# Altium project ECG.PrjPcb
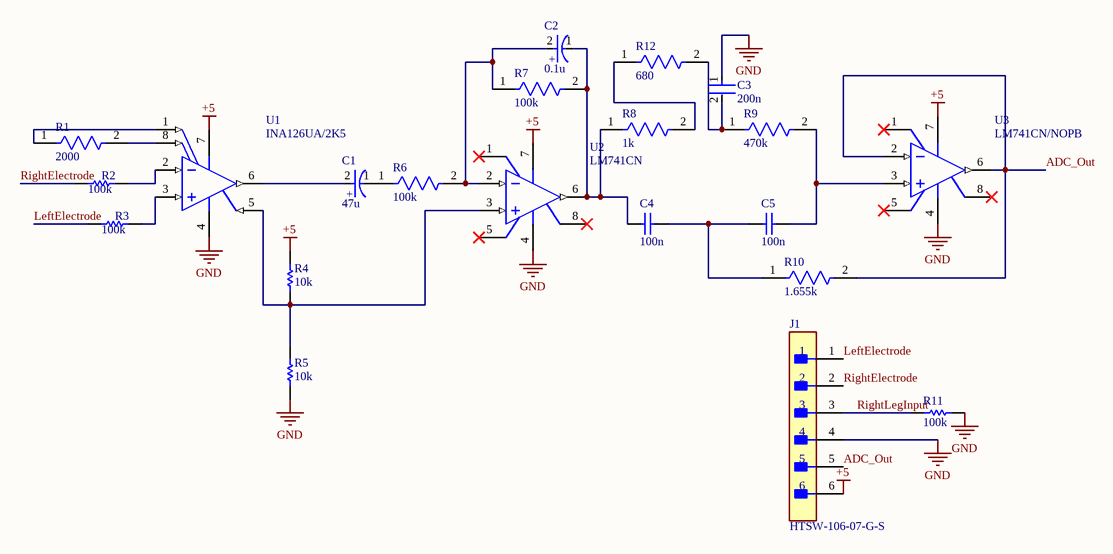
[diagram p0: ECG.SchDoc]
1 sheet, 21 parts. Net scope: global (net labels, ports and power ports of the same name join across sheets).
Board files: ECG_old.PcbDoc, ECG.PcbDoc

## Sheet ECG.SchDoc
size A; SheetNumber: 1; SheetTotal: 1

### Parts
C1  47u  [FP-RAD-TH-D_8_0_5-L_20_2-MFG]
C2  0.1u  [FP-RAD-TH-D_8_0_5-L_20_2-MFG]
C3  200n  [FP-R82DC4100DQ60J-MFG]
C4  100n  [CAPR51-254-508X318X736]
C5  100n  [CAPR51-254-508X318X736]
J1  HTSW-106-07-G-S  [FP-HTSW-106-07-G-S-MFG]
R1  2000  [FP-MRS25-MFG]
R2  value 100k  [6-0805_N]  (hidden comment: Res 0805)
R3  value 100k  [6-0805_N]  (hidden comment: Res 0805)
R4  value 10k  [6-0805_N]  (hidden comment: Res 0805)
R5  value 10k  [6-0805_N]  (hidden comment: Res 0805)
R6  100k  [FP-MRS25-MFG]
R7  100k  [FP-MRS25-MFG]
R8  1k  [FP-MRS25-MFG]
R9  470k  [FP-MRS25-MFG]
R10  1.655k  [FP-MRS25-MFG]
R11  value 100k  [6-0805_N]  (hidden comment: Res 0805)
R12  680  [FP-MRS25-MFG]
U1  INA126UA/2K5  [D0008A_N]
U2  LM741CN  [P0008A]
U3  LM741CN/NOPB  [P0008A]

### Nets
+5: J1.6 R4.2 U1.7(V+) U2.7(V+) U3.7(V+)
GND: C3.1 J1.4 R5.1 R11.2 U1.4(V-) U2.4(V-) U3.4(V-)
ADC_Out: J1.5 R10.2 U3.2(IN-) U3.6(OUT)
LeftElectrode: J1.1 R3.1
RightElectrode: J1.2 R2.1
RightLegInput: J1.3 R11.1
NetC1_1: C1.1(C) R6.1
NetC1_2: C1.2(A) U1.6(VO)
NetC2_1: C2.1(C) C4.1 R7.2 R8.1 U2.6(OUT)
NetC2_2: C2.2(A) R6.2 R7.1 U2.2(IN-)
NetC3_2: C3.2 R9.1 R12.2
NetC4_2: C4.2 C5.1 R10.1
NetC5_2: C5.2 R9.2 U3.3(IN+)
NetR1_1: R1.1 U1.1(RG)
NetR1_2: R1.2 U1.8(RG)
NetR2_2: R2.2 U1.2(VIN-)
NetR3_2: R3.2 U1.3(VIN+)
NetR4_1: R4.1 R5.2 U1.5(REF) U2.3(IN+)
NetR8_2: R8.2 R12.1

Not connected (* = marked no-connect by the designer): U2 1(OFS_NULL)* 5(OFS_NULL)* 8(NC)*; U3 1(OFS_NULL)* 5(OFS_NULL)* 8(NC)*

### Notes on the sheet
- (in symbol CMP-05427-001204-1) +

### Library data of the parts
C1 C2 = CMP-05427-001204-1: Aluminum Electrolytic Capacitors (Radial Lead Type) AEC-Q200 Qualified 270uF ±20% 35V
C3 = CMP-03022-000017-1: CAP FILM 1UF 5% 63VDC RADIAL; Voltage Rating (DC): 63V; Lead Diameter: 0.5mm; Insulation Resistance: 30R; Dielectric: PET; Voltage Rating (AC): 40V; Dissipation Factor: 80%; Life (Hours): 2000Hour; Type: General Purpose; Mount: Through Hole; Case/Package: Radial; Package Quantity: 1700; Construction: RADIAL; Capacitance: 1uF; Lead Pitch: 5mm; Depth: 5mm; Series: R82; Packaging: Tape and Reel; RoHS Compliant: Yes; Voltage Rating: 63V; Height - Seated (Max): 0.398inch; Voltage: 63V; Radiation Hardening: No; Width: 5mm; REACH SVHC: No SVHC; Min Operating Temperature: -55°C; Tolerance: 5%; Dielectric Material: PET; Contact Plating: Tin; Termination: Radial; Length: 7.2mm; Max Operating Temperature: 105°C
C4 C5 = CMP-1664-00004-1: Radial Leaded Multilayer Ceramic Capacitor, 0.1 uF, +/- 10%, 50 V, -55 to 125 degC, 2-Pin THD, RoHS, Tape and Reel; Case\Package: SOT-23-5; Max Power Dissipation: 250 mW; Output Current: 150 mA; Dropout Voltage: 260 mV; Outputs: 1; Output Voltage: 5 V; Max Input Voltage: 8 V; Min Operating Temperature: -40 degC; Packaging: Tape and Reel; Height: 1.3 mm; Radiation Hardening: No; Pins: 5; ComponentLink1Description: Manufacturer URL; Mount: Surface Mount; RoHSCompliant: true; Max Operating Temperature: 85 degC; PackageReference: CAPR51-254-508X318X736; ComponentLink2URL: http://www.kemet.com/docfinder?Partnumber=C320C104K5R5TA; PackageDescription: 2-Pin Through Hole Device, Body 5.08 x 3.18 mm, Pitch 2.54 mm; ComponentLink1URL: http://www.kemet.com/; Width: 1.8 mm; Package Quantity: 3000; DatasheetVersion: Dec-15; Length: 3 mm; ComponentLink2Description: Datasheet
J1 = CMP-02766-001515-1: CONN HEADER VERT 6POS 2.54MM; Number of Positions: 6; Pitch: 0.1inch; Max Voltage Rating (AC): 550V; Gender: Male; Max Current Rating: 7.6A; Contact Type: Male Pin; Contact Finish - Mating: GOLD; REACH SVHC: No SVHC; Number of Rows: 1; Insulation Material: Polymer; Housing Color: Natural; Connector Type: Header; Termination: Solder; Flammability Rating: UL94 V-0; Mount: Through Hole; Contact Shape: Square; Fastening Type: Pull; Max Operating Temperature: 125°C; Contact Material: Bronze; RoHS Compliant: Yes; Series: HTSW; Min Operating Temperature: -55°C; Contact Mating Length: 0.23inch; Orientation: Straight; Number of Contacts: 6; Depth: 2.48mm; Housing Material: Polymer; Insulation Color: Natural; Lead Free: Lead Free; Radiation Hardening: No; Length: 15.24mm; Contact Plating: Gold; Color: Natural; Packaging: Rail/Tube
R1 R6-R10 R12 = CMP-00030-42757237-1: MRS25000C1000FRP00 Resistor, 100 Ohm, ± 1%, 600 mW, Axial Leaded, Metal Film (Thin Film), Professional; Max Power Dissipation: 600mW; Resistance: 100Ω; Voltage Rating: 350V; Temperature Coefficient: 50ppm/°C; Lead Diameter: 600µm; RoHS: Compliant; Radiation Hardening: No; Schedule B: 8533210090, 8533210090; Length: 6.5mm; Packaging: Tape & Reel (TR); Number of Terminations: 2; Mount: Through Hole; Width: 2.5mm; Tolerance: 1%; Military Standard: Not; Voltage Rating (DC): 350V; Contact Plating: Tin; Number of Pins: 2; Max Operating Temperature: 155°C; NexarPartId: 42757237; Diameter: 2.5mm; Composition: Metal Film, Thin Film; REACH SVHC: Unknown; Power Rating: 600mW; Lead Free: Lead Free; Termination: Axial; Case/Package: Axial; Min Operating Temperature: -55°C
R2-R5 R11 = CMP-009-00180-12: Resistor; Power: 125mW; Case/Package: 0805; PackageReference: AXIAL-0.3; Published: 8-Jun-2000; LatestRevisionNote: Re-released for DXP Platform.; Source: PCB Footprint.SCHLIB; LatestRevisionDate: 17-Jul-2002; Publisher: Altium Limited; Pins: 2; Signal Integrity: Res; Component Type: Standard; Design Item ID: Res1
U1 = CMP-0992-00053-2: Micropower Instrumentation Amplifier Single and Dual Versions, -40 to 85 degC, 8-pin SOIC (D8), Green (RoHS & no Sb/Br); Manufacturer: Texas Instruments; Input Bias Current (+/-)(Max)(nA): 50; Vs(Min)(V): 2.7; Non-Linearity (+/-)(Max)(%): 0.012; CMRR(Min)(dB): 74; SubFamily: Dual Supply; Vs(Max)(V): 36; Quiescent Current (+/-)(Typ)(mA): 0.175; Input Offset (+/-)(Max)(uV): 500; Input Offset Drift (+/-)(Max)(uV/Degrees Celsius): 5; Number of Channels: 1; Gain(V/V): 5 to 10000; Noise at 1kHz(Typ)(nV/rt(Hz)): 35; PackageVersion: 4040047-3/M, 06/2011; ComponentLink3Description: Package Specification; ComponentLink2Description: Datasheet; Code_JEDEC: MS-012; ComponentLink1Description: Manufacturer URL; PackageDescription: 8-Pin Plastic Small Outline, Body 4.9 x 3.9 mm, Pitch 1.27 mm; PackageReference: D0008A; PartNumber: INA126UA/2K5; ComponentLink2URL: http://www.ti.com/general/docs/lit/getliterature.tsp?genericPartNumber=INA126&fileType=pdf; Mounting Technology: Surface Mount; ComponentLink1URL: http://www.ti.com/; ComponentLink3URL: http://www.ti.com/litv/pdf/msoi002j; DatasheetVersion: SBOS062A; Eco-Plan: Green (RoHS & no Sb/Br)
U2 U3 = CMP-0055-00162-3: Operational Amplifier, 8-pin MDIP, Pb-Free; Manufacturer: Texas Instruments; PackageTopMarking: NSUZXYTTE#*LM*741CN; PowerWise: N; CompType: Amplifiers; ComponentLink1Description: Datasheet URL; ComponentLink1URL: http://www.ti.com/general/docs/lit/getliterature.tsp?genericPartNumber=LM741&fileType=pdf; PackageDescription: MDIP, .365 x .250 x .130in, 8 Lead, .100in Pitch; RoHS: Y; PinCount: 8; Code_JEDEC: MS-001-BA; Package Reference: P0008A